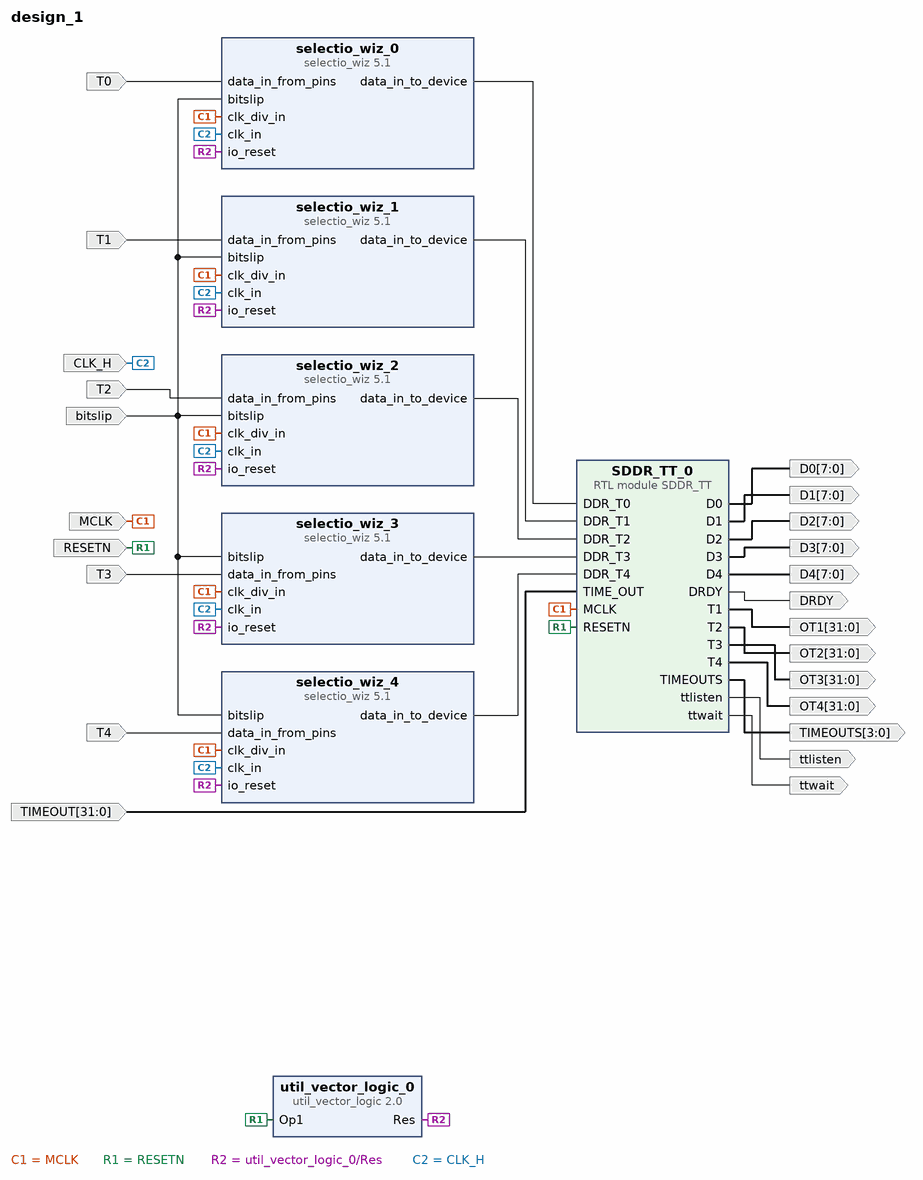
[diagram p0: block diagram of the top level]
# Vivado block design design_1, xc7z020clg400-1, Vivado 2019.1
create_bd_design design_1

create_bd_port -dir I CLK_H
create_bd_port -dir I MCLK
create_bd_port -dir I T0
create_bd_port -dir I T1
create_bd_port -dir I T2
create_bd_port -dir I T3
create_bd_port -dir I T4
create_bd_port -dir I RESETN
create_bd_port -dir I bitslip
create_bd_port -dir I -from 31 -to 0 TIMEOUT
create_bd_port -dir O -from 31 -to 0 OT1
create_bd_port -dir O -from 31 -to 0 OT2
create_bd_port -dir O -from 31 -to 0 OT3
create_bd_port -dir O -from 31 -to 0 OT4
create_bd_port -dir O -from 7 -to 0 D0
create_bd_port -dir O -from 7 -to 0 D1
create_bd_port -dir O -from 7 -to 0 D2
create_bd_port -dir O -from 7 -to 0 D3
create_bd_port -dir O -from 7 -to 0 D4
create_bd_port -dir O DRDY
create_bd_port -dir O -from 3 -to 0 TIMEOUTS
create_bd_port -dir O ttwait
create_bd_port -dir O ttlisten

create_bd_cell -type ip -vlnv xilinx.com:ip:selectio_wiz:5.1 selectio_wiz_0
set_property -dict [list \
  CONFIG.BUS_IO_STD LVCMOS33 \
  CONFIG.CLK_FWD_IO_STD LVCMOS33 \
  CONFIG.SELIO_ACTIVE_EDGE DDR \
  CONFIG.SELIO_CLK_BUF MMCM \
  CONFIG.SELIO_CLK_IO_STD LVCMOS33 \
  CONFIG.SELIO_INTERFACE_TYPE NETWORKING \
  CONFIG.SERIALIZATION_FACTOR 4 \
  CONFIG.USE_SERIALIZATION true \
] [get_bd_cells selectio_wiz_0]
create_bd_cell -type module -reference SDDR_TT SDDR_TT_0
create_bd_cell -type ip -vlnv xilinx.com:ip:selectio_wiz:5.1 selectio_wiz_1
set_property -dict [list \
  CONFIG.BUS_IO_STD LVCMOS33 \
  CONFIG.CLK_FWD_IO_STD LVCMOS33 \
  CONFIG.SELIO_ACTIVE_EDGE DDR \
  CONFIG.SELIO_CLK_BUF MMCM \
  CONFIG.SELIO_CLK_IO_STD LVCMOS33 \
  CONFIG.SELIO_INTERFACE_TYPE NETWORKING \
  CONFIG.SERIALIZATION_FACTOR 4 \
  CONFIG.USE_SERIALIZATION true \
] [get_bd_cells selectio_wiz_1]
create_bd_cell -type ip -vlnv xilinx.com:ip:selectio_wiz:5.1 selectio_wiz_2
set_property -dict [list \
  CONFIG.BUS_IO_STD LVCMOS33 \
  CONFIG.CLK_FWD_IO_STD LVCMOS33 \
  CONFIG.SELIO_ACTIVE_EDGE DDR \
  CONFIG.SELIO_CLK_BUF MMCM \
  CONFIG.SELIO_CLK_IO_STD LVCMOS33 \
  CONFIG.SELIO_INTERFACE_TYPE NETWORKING \
  CONFIG.SERIALIZATION_FACTOR 4 \
  CONFIG.USE_SERIALIZATION true \
] [get_bd_cells selectio_wiz_2]
create_bd_cell -type ip -vlnv xilinx.com:ip:selectio_wiz:5.1 selectio_wiz_3
set_property -dict [list \
  CONFIG.BUS_IO_STD LVCMOS33 \
  CONFIG.CLK_FWD_IO_STD LVCMOS33 \
  CONFIG.SELIO_ACTIVE_EDGE DDR \
  CONFIG.SELIO_CLK_BUF MMCM \
  CONFIG.SELIO_CLK_IO_STD LVCMOS33 \
  CONFIG.SELIO_INTERFACE_TYPE NETWORKING \
  CONFIG.SERIALIZATION_FACTOR 4 \
  CONFIG.USE_SERIALIZATION true \
] [get_bd_cells selectio_wiz_3]
create_bd_cell -type ip -vlnv xilinx.com:ip:selectio_wiz:5.1 selectio_wiz_4
set_property -dict [list \
  CONFIG.BUS_IO_STD LVCMOS33 \
  CONFIG.CLK_FWD_IO_STD LVCMOS33 \
  CONFIG.SELIO_ACTIVE_EDGE DDR \
  CONFIG.SELIO_CLK_BUF MMCM \
  CONFIG.SELIO_CLK_IO_STD LVCMOS33 \
  CONFIG.SELIO_INTERFACE_TYPE NETWORKING \
  CONFIG.SERIALIZATION_FACTOR 4 \
  CONFIG.USE_SERIALIZATION true \
] [get_bd_cells selectio_wiz_4]
create_bd_cell -type ip -vlnv xilinx.com:ip:util_vector_logic:2.0 util_vector_logic_0
set_property -dict {CONFIG.C_OPERATION not CONFIG.C_SIZE 1} [get_bd_cells util_vector_logic_0]

# ---- connections ----

connect_bd_net [get_bd_pins selectio_wiz_0/data_in_to_device] [get_bd_pins SDDR_TT_0/DDR_T0]
connect_bd_net [get_bd_pins selectio_wiz_1/data_in_to_device] [get_bd_pins SDDR_TT_0/DDR_T1]
connect_bd_net [get_bd_pins selectio_wiz_2/data_in_to_device] [get_bd_pins SDDR_TT_0/DDR_T2]
connect_bd_net [get_bd_pins selectio_wiz_3/data_in_to_device] [get_bd_pins SDDR_TT_0/DDR_T3]
connect_bd_net [get_bd_pins selectio_wiz_4/data_in_to_device] [get_bd_pins SDDR_TT_0/DDR_T4]
connect_bd_net -net T0_1 [get_bd_ports T0] [get_bd_pins selectio_wiz_0/data_in_from_pins]
connect_bd_net -net T1_1 [get_bd_ports T1] [get_bd_pins selectio_wiz_1/data_in_from_pins]
connect_bd_net -net T2_1 [get_bd_ports T2] [get_bd_pins selectio_wiz_2/data_in_from_pins]
connect_bd_net -net T3_1 [get_bd_ports T3] [get_bd_pins selectio_wiz_3/data_in_from_pins]
connect_bd_net -net T4_1 [get_bd_ports T4] [get_bd_pins selectio_wiz_4/data_in_from_pins]
connect_bd_net [get_bd_ports MCLK] \
  [get_bd_pins selectio_wiz_0/clk_div_in] [get_bd_pins selectio_wiz_1/clk_div_in] [get_bd_pins selectio_wiz_2/clk_div_in] \
  [get_bd_pins selectio_wiz_3/clk_div_in] [get_bd_pins selectio_wiz_4/clk_div_in] [get_bd_pins SDDR_TT_0/MCLK]
connect_bd_net [get_bd_ports RESETN] [get_bd_pins util_vector_logic_0/Op1] [get_bd_pins SDDR_TT_0/RESETN]
connect_bd_net [get_bd_pins util_vector_logic_0/Res] \
  [get_bd_pins selectio_wiz_0/io_reset] [get_bd_pins selectio_wiz_1/io_reset] [get_bd_pins selectio_wiz_2/io_reset] \
  [get_bd_pins selectio_wiz_3/io_reset] [get_bd_pins selectio_wiz_4/io_reset]
connect_bd_net [get_bd_ports CLK_H] \
  [get_bd_pins selectio_wiz_0/clk_in] [get_bd_pins selectio_wiz_1/clk_in] [get_bd_pins selectio_wiz_3/clk_in] \
  [get_bd_pins selectio_wiz_4/clk_in] [get_bd_pins selectio_wiz_2/clk_in]
connect_bd_net [get_bd_ports bitslip] \
  [get_bd_pins selectio_wiz_2/bitslip] [get_bd_pins selectio_wiz_4/bitslip] [get_bd_pins selectio_wiz_3/bitslip] \
  [get_bd_pins selectio_wiz_1/bitslip] [get_bd_pins selectio_wiz_0/bitslip]
connect_bd_net [get_bd_ports TIMEOUT] [get_bd_pins SDDR_TT_0/TIME_OUT]
connect_bd_net [get_bd_pins SDDR_TT_0/T1] [get_bd_ports OT1]
connect_bd_net [get_bd_pins SDDR_TT_0/T2] [get_bd_ports OT2]
connect_bd_net [get_bd_pins SDDR_TT_0/T3] [get_bd_ports OT3]
connect_bd_net [get_bd_pins SDDR_TT_0/T4] [get_bd_ports OT4]
connect_bd_net [get_bd_pins SDDR_TT_0/D0] [get_bd_ports D0]
connect_bd_net [get_bd_pins SDDR_TT_0/D1] [get_bd_ports D1]
connect_bd_net [get_bd_pins SDDR_TT_0/D2] [get_bd_ports D2]
connect_bd_net [get_bd_pins SDDR_TT_0/D3] [get_bd_ports D3]
connect_bd_net [get_bd_pins SDDR_TT_0/D4] [get_bd_ports D4]
connect_bd_net [get_bd_pins SDDR_TT_0/DRDY] [get_bd_ports DRDY]
connect_bd_net [get_bd_pins SDDR_TT_0/TIMEOUTS] [get_bd_ports TIMEOUTS]
connect_bd_net [get_bd_pins SDDR_TT_0/ttwait] [get_bd_ports ttwait]
connect_bd_net [get_bd_pins SDDR_TT_0/ttlisten] [get_bd_ports ttlisten]

validate_bd_design
save_bd_design
